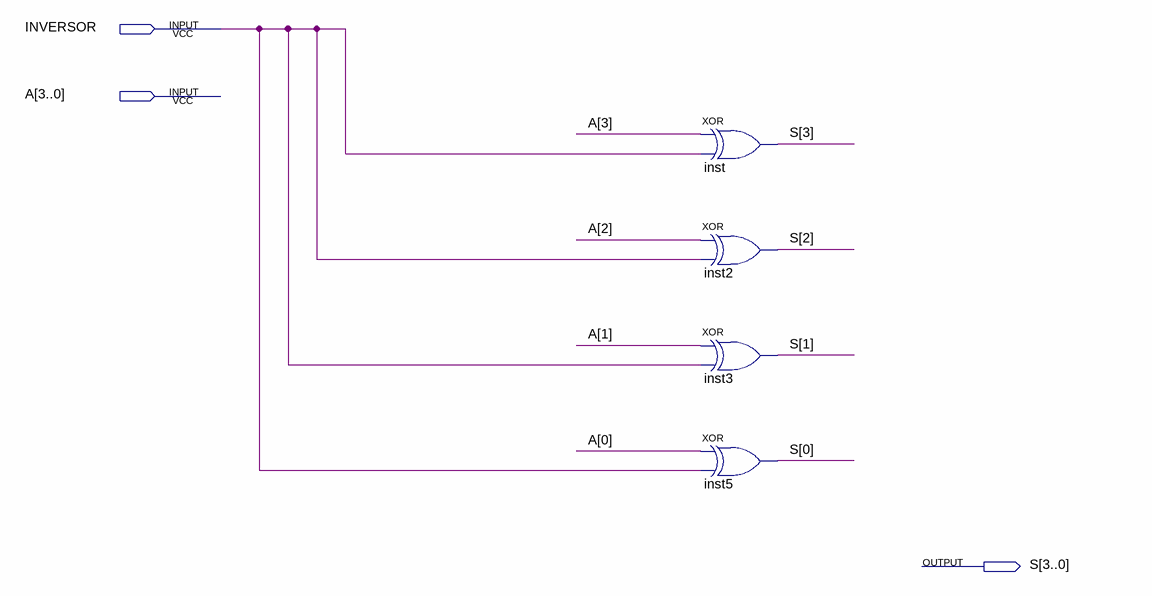
[diagram p0: schematic sheet]
// Quartus schematic InversorLogico.bdf as structural Verilog: 4 symbols, 3 pins
module InversorLogico (
  input  INVERSOR,
  input  [3:0] A,
  output [3:0] S
);

  xor inst (S[3], A[3], INVERSOR);
  xor inst2 (S[2], A[2], INVERSOR);
  xor inst3 (S[1], A[1], INVERSOR);
  xor inst5 (S[0], A[0], INVERSOR);
endmodule
